# Altium project Sterownik.PrjPcb (part 1 of 2)
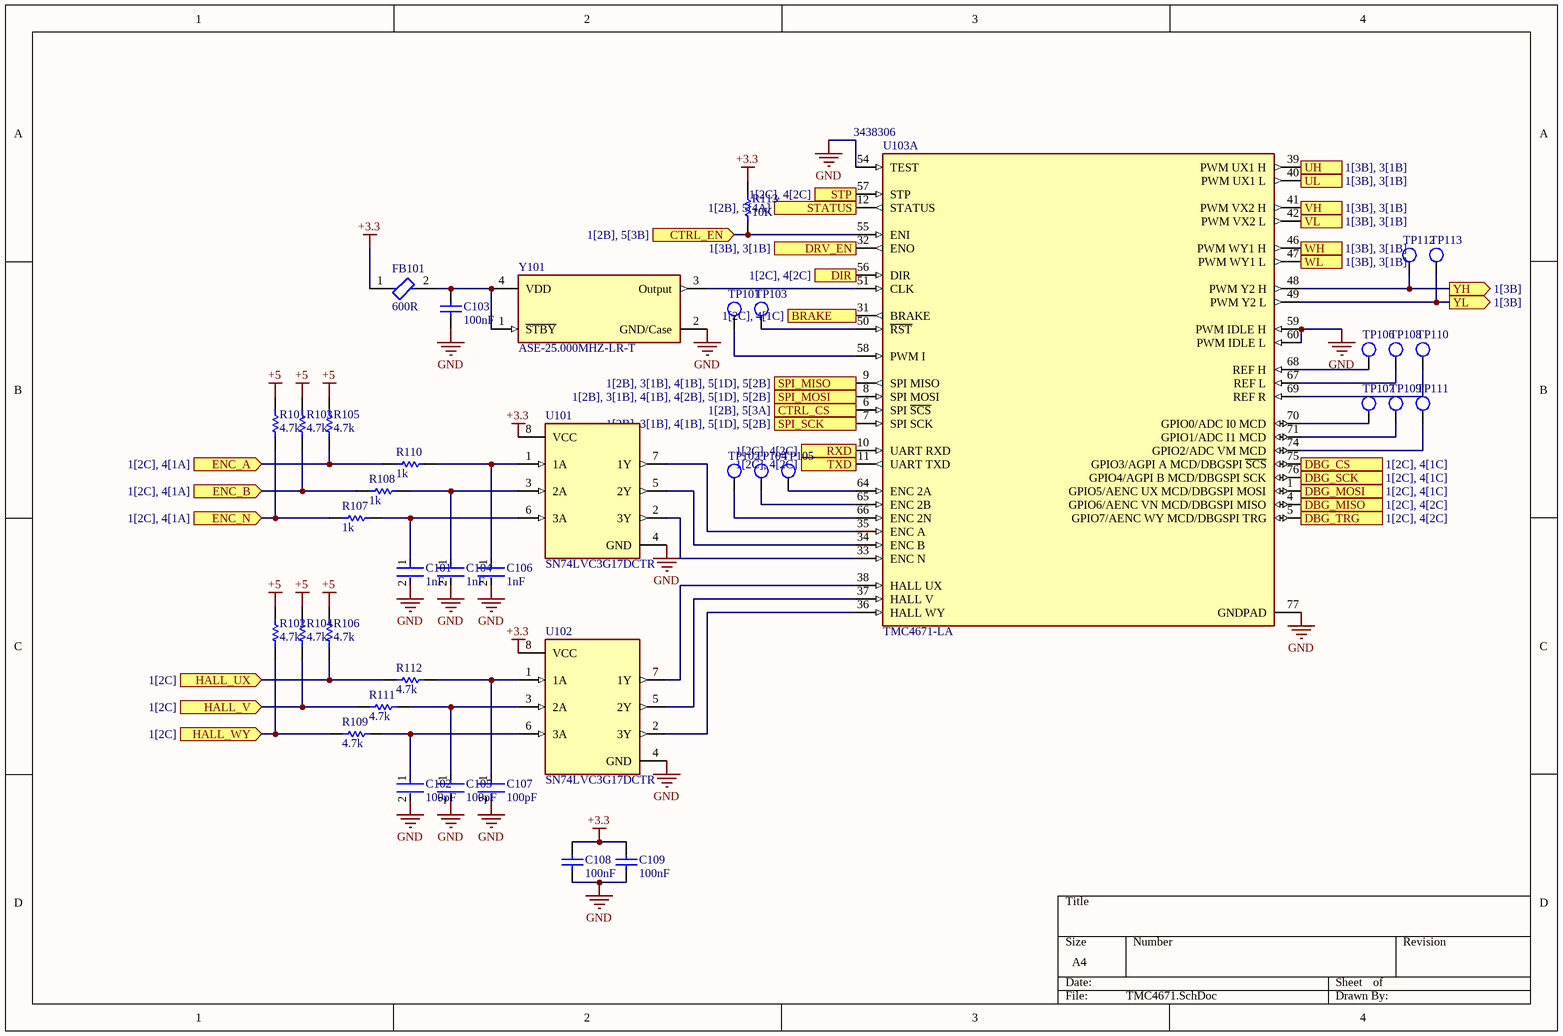
[diagram p0: TMC4671.SchDoc]
5 sheets, 135 parts. Net scope: flat (ports and power ports of the same name join across sheets).
Board file: PCB1.PcbDoc
Sheets:
  TMC4671.SchDoc
  TMC6100.SchDoc
  Connectors.SchDoc
  MOSFETs.SchDoc
  Power.SchDoc

## Sheet TMC4671.SchDoc
size A4; SheetNumber: 2; SheetTotal: 7

### Parts
C101  1nF  [FP-C0603C-CF-MFG]
C102  100pF  [FP-C0603C-CF-IPC_B]
C103  100nF  [CAPC1608X90X35NL10T15]
C104  1nF  [FP-C0603C-CF-MFG]
C105  100pF  [FP-C0603C-CF-IPC_B]
C106  1nF  [FP-C0603C-CF-MFG]
C107  100pF  [FP-C0603C-CF-IPC_B]
C108  100nF  [CAPC1608X90X35NL10T15]
C109  100nF  [CAPC1608X90X35NL10T15]
FB101  600R  [FP-742792651-MFG]
R101  4.7k  [RESC1608X55X30NL15T15]
R102  4.7k  [RESC1608X55X30NL15T15]
R103  4.7k  [RESC1608X55X30NL15T15]
R104  4.7k  [RESC1608X55X30NL15T15]
R105  4.7k  [RESC1608X55X30NL15T15]
R106  4.7k  [RESC1608X55X30NL15T15]
R107  1k  [RESC1608X55X30ML15T15]
R108  1k  [RESC1608X55X30ML15T15]
R109  4.7k  [RESC1608X55X30NL15T15]
R110  1k  [RESC1608X55X30ML15T15]
R111  4.7k  [RESC1608X55X30NL15T15]
R112  4.7k  [RESC1608X55X30NL15T15]
R113  10K  [RESC1609X55X30LL15T15]
TP101  TestPoint  [PCBComponent_1]  (value not drawn)  (no BOM)
TP102  TestPoint  [PCBComponent_1]  (value not drawn)  (no BOM)
TP103  TestPoint  [PCBComponent_1]  (value not drawn)  (no BOM)
TP104  TestPoint  [PCBComponent_1]  (value not drawn)  (no BOM)
TP105  TestPoint  [PCBComponent_1]  (value not drawn)  (no BOM)
TP106  TestPoint  [PCBComponent_1]  (value not drawn)  (no BOM)
TP107  TestPoint  [PCBComponent_1]  (value not drawn)  (no BOM)
TP108  TestPoint  [PCBComponent_1]  (value not drawn)  (no BOM)
TP109  TestPoint  [PCBComponent_1]  (value not drawn)  (no BOM)
TP110  TestPoint  [PCBComponent_1]  (value not drawn)  (no BOM)
TP111  TestPoint  [PCBComponent_1]  (value not drawn)  (no BOM)
TP112  TestPoint  [PCBComponent_1]  (value not drawn)  (no BOM)
TP113  TestPoint  [PCBComponent_1]  (value not drawn)  (no BOM)
U101  SN74LVC3G17DCTR  [FP-DCT0008A-IPC_B]
U102  SN74LVC3G17DCTR  [FP-DCT0008A-IPC_B]
U103  TMC4671-LA  Supplier Part Number 1: 3438306  [FP-TMC4671-LA-IPC_A]  (part A of 2)
Y101  ASE-25.000MHZ-LR-T  [FP-ASE-MFG]

### Ports
BRAKE (out, see 1[2C], 4[1C]), CTRL_CS (in, see 1[2B], 5[3A]), CTRL_EN (in, see 1[2B], 5[3B]), DBG_CS (out, see 1[2C], 4[1C]), DBG_MISO (in, see 1[2C], 4[2C]), DBG_MOSI (out, see 1[2C], 4[1C]), DBG_SCK (out, see 1[2C], 4[1C]), DBG_TRG (out, see 1[2C], 4[2C]), DIR (in, see 1[2C], 4[2C]), DRV_EN (out, see 1[3B], 3[1B]), ENC_A (in, see 1[2C], 4[1A]), ENC_B (in, see 1[2C], 4[1A]), ENC_N (in, see 1[2C], 4[1A]), HALL_UX (in, see 1[2C]), HALL_V (in, see 1[2C]), HALL_WY (in, see 1[2C]), RXD (in, see 1[2C], 4[2C]), SPI_MISO (out, see 1[2B], 3[1B], 4[1B], 5[1D], 5[2B]), SPI_MOSI (in, see 1[2B], 3[1B], 4[1B], 4[2B], 5[1D], 5[2B]), SPI_SCK (in, see 1[2B], 3[1B], 4[1B], 5[1D], 5[2B]), STATUS (out, see 1[2B], 5[4A]), STP (in, see 1[2C], 4[2C]), TXD (out, see 1[2C], 4[2C]), UH (out, see 1[3B], 3[1B]), UL (out, see 1[3B], 3[1B]), VH (out, see 1[3B], 3[1B]), VL (out, see 1[3B], 3[1B]), WH (out, see 1[3B], 3[1B]), WL (out, see 1[3B], 3[1B]), YH (out, see 1[3B]), YL (out, see 1[3B])

### Nets
+3.3: C108.1 C109.1 FB101.1 R113.2 U101.8(VCC) U102.8(VCC)
+5: R101.2 R102.2 R103.2 R104.2 R105.2 R106.2
GND: C101.2 C102.2 C103.2 C104.2 C105.2 C106.2 C107.2 C108.2 C109.2 U101.4(GND) U102.4(GND) U103.54(TEST) U103.59(PWM_IDLE_H) U103.60(PWM_IDLE_L) U103.77(GNDPAD) Y101.2(GND/Case)
NetC101_1: C101.1 R107.2 U101.6(3A)
NetC102_1: C102.1 R109.1 U102.6(3A)
NetC103_1: C103.1 FB101.2 Y101.1(~{STBY}) Y101.4(VDD)
NetC104_1: C104.1 R108.2 U101.3(2A)
NetC105_1: C105.1 R111.1 U102.3(2A)
NetC106_1: C106.1 R110.2 U101.1(1A)
NetC107_1: C107.1 R112.1 U102.1(1A)
NetJ403_2: R105.1 R110.1 ; port ENC_A
NetJ403_3: R103.1 R108.1 ; port ENC_B
NetJ403_4: R101.1 R107.1 ; port ENC_N
NetJ404_2: R106.1 R112.2 ; port HALL_UX
NetJ404_3: R104.1 R111.2 ; port HALL_V
NetJ404_4: R102.1 R109.2 ; port HALL_WY
NetJ405_2: U103.7(SPI_SCK) ; port SPI_SCK
NetJ405_4: U103.8(SPI_MOSI) ; port SPI_MOSI
NetJ405_5: U103.9(SPI_MISO) ; port SPI_MISO
NetP405_3: U103.75(GPIO3/AGPI_A_MCD/DBGSPI_~{SCS}) ; port DBG_CS
NetP405_4: U103.4(GPIO6/AENC_VN_MCD/DBGSPI_MISO) ; port DBG_MISO
NetP405_5: U103.76(GPIO4/AGPI_B_MCD/DBGSPI_SCK) ; port DBG_SCK
NetP405_6: U103.5(GPIO7/AENC_WY_MCD/DBGSPI_TRG) ; port DBG_TRG
NetP405_7: U103.1(GPIO5/AENC_UX_MCD/DBGSPI_MOSI) ; port DBG_MOSI
NetP406_1: U103.31(BRAKE) ; port BRAKE
NetP408_1: U103.11(UART_TXD) ; port TXD
NetP408_2: U103.10(UART_RXD) ; port RXD
NetP409_1: U103.57(STP) ; port STP
NetP409_2: U103.56(DIR) ; port DIR
NetR113_1: R113.1 U103.55(ENI) ; port CTRL_EN
NetTP101_1: TP101.1 U103.58(PWM_I)
NetTP102_1: TP102.1 U103.66(ENC_2N)
NetTP103_1: TP103.1 U103.50(~{RST})
NetTP104_1: TP104.1 U103.65(ENC_2B)
NetTP105_1: TP105.1 U103.64(ENC_2A)
NetTP106_1: TP106.1 U103.68(REF_H)
NetTP107_1: TP107.1 U103.70(GPIO0/ADC_I0_MCD)
NetTP108_1: TP108.1 U103.67(REF_L)
NetTP109_1: TP109.1 U103.71(GPIO1/ADC_I1_MCD)
NetTP110_1: TP110.1 U103.69(REF_R)
NetTP111_1: TP111.1 U103.74(GPIO2/ADC_VM_MCD)
NetTP112_1: TP112.1 U103.48(PWM_Y2_H) ; port YH
NetTP113_1: TP113.1 U103.49(PWM_Y2_L) ; port YL
NetU101_2: U101.2(3Y) U103.33(ENC_N)
NetU101_5: U101.5(2Y) U103.34(ENC_B)
NetU101_7: U101.7(1Y) U103.35(ENC_A)
NetU102_2: U102.2(3Y) U103.36(HALL_WY)
NetU102_5: U102.5(2Y) U103.37(HALL_V)
NetU102_7: U102.7(1Y) U103.38(HALL_UX)
NetU103_6: U103.6(SPI_~{SCS}) ; port CTRL_CS
NetU103_12: U103.12(STATUS) ; port STATUS
NetU103_32: U103.32(ENO) ; port DRV_EN
NetU103_39: U103.39(PWM_UX1_H) ; port UH
NetU103_40: U103.40(PWM_UX1_L) ; port UL
NetU103_41: U103.41(PWM_VX2_H) ; port VH
NetU103_42: U103.42(PWM_VX2_L) ; port VL
NetU103_46: U103.46(PWM_WY1_H) ; port WH
NetU103_47: U103.47(PWM_WY1_L) ; port WL
NetU103_51: U103.51(CLK) Y101.3(Output)

### Library data of the parts
C101 C104 C106 = CMP-2006-03015-2: CAP CER 1000PF 100V 10% X7R 0603; Manufacturer: KEMET; Manufacturer Part Number: C0603C102K1RACTU; Value: 1,000 pF; Tolerance: 0.1; Automotive Grade: Grade 1; Temperature Coefficient: 30ppm/°C; Material: Ceramic; Temperature Range High: +125°C; RoHS: TRUE; Temperature Range Low: -55°C; ComponentLink2URL: https://api.kemet.com/component-edge/download/datasheet/C0603C100J5GACAUTO.pdf; Lead Free: Yes; Device Class L2: Capacitors; Voltage Rating: 100 V; Package: C0603C-CF; Category: Cap; Temperature: -55°C to +125°C; Device Class L3: Ceramic Capacitors; Mouser Description: Multilayer Ceramic Capacitors MLCC - SMD/SMT 100volts 1000pF X7R 10%; Height: 0.87mm; ComponentLink2Description: Datasheet; Digikey Description: CAP CER 1000PF 100V 10% X7R 0603; Temperature Characteristic: X7R; Capacitance: 1,000 pF; Automotive: Yes; Octopart: https://octopart.com/c0603c102k1ractu-kemet-9138575; Device Class L1: Passive Components
C102 C105 C107 = CMP-2006-03007-2: CAP CER 100PF 50V 10% X7R 0603; Manufacturer: KEMET; Manufacturer Part Number: C0603C101K5RACTU; Tolerance: 0.1; Material: Ceramic; Temperature Coefficient: 30ppm/°C; Automotive Grade: Grade 1; Value: 100 pF; RoHS: TRUE; ComponentLink2Description: Datasheet; Device Class L2: Capacitors; Category: Cap; Package: C0603C-CF; Automotive: Yes; Temperature Range High: +125°C; Temperature Range Low: -55°C; Temperature Characteristic: X7R; Device Class L3: Ceramic Capacitors; Mouser Description: Multilayer Ceramic Capacitors MLCC - SMD/SMT 50volts 100pF 10%; Device Class L1: Passive Components; Capacitance: 100 pF; Height: 0.87mm; ComponentLink2URL: https://api.kemet.com/component-edge/download/datasheet/C0603C100J5GACAUTO.pdf; Temperature: -55°C to +125°C; Octopart: https://octopart.com/c0603c101k5ractu-kemet-10561249; Digikey Description: CAP CER 100PF 50V 10% X7R 0603; Voltage Rating: 50 V; Lead Free: Yes
C103 C108 C109 = CMP-2100-03643-1: Chip Capacitor, 0.1 uF, +/- 10%, 50 V, -55 to 125 degC, 0603 (1608 Metric), RoHS, Tape and Reel; Manufacturer: Murata; Dielectric Material: Ceramic; Voltage Rating: 50V; Dielectric: X7R; Insulation Resistance: 10GR; Case Code (Metric): 1608; Lead Free: LeadFree; Depth: 0.8mm; Number of Pins: 2; Radiation Hardening: No; Case/Package: 0603; Manufacturer URL: http://www.murata.com/; Packaging: TapeandReel; Length: 1.6mm; Contact Plating: Tin; Datasheet URL: http://psearch.en.murata.com/capacitor/product/GRM188R71H104KA93%23.pdf; Tolerance: 10%; Case Code (Imperial): 0603; Min Operating Temperature: -55degC; RoHSCompliant: true; Capacitance: 100nF; Voltage: 50V; Termination: SMD/SMT; Mount: SurfaceMount; Material: Ceramic; Package Quantity: 1; Height: 0.8mm; Thickness: 0.035inch; REACH SVHC: NoSVHC; Max Operating Temperature: 125degC; Width: 0.8mm; Package Reference: 0603; Voltage Rating (DC): 50V; Datasheet Version: 42675.0; Package Description: 2-Pin Surface Mount Device, Body 1.6 x 0.8 mm
FB101 = CMP-0220-00181-2: FERRITE BEAD 600 OHM 0603 1LN; Tolerance: 25%; DC Resistance (DCR): 200mR; Inductance: 0.36H; Current Rating: 1A; Test Frequency: 100MHz; Number of Lines: 1; Length: 1.6mm; Termination: SMD/SMT; Case Code (Metric): 1608; Case/Package: SMD/SMT; Min Operating Temperature: -55°C; Resistance: 200mR; Height: 0.8mm; Width: 0.8mm; Max Operating Temperature: 125°C; Package Quantity: 1; Mount: Surface Mount; Max DC Current: 1A; Max Current Rating: 1A; Weight: 0.000141oz; Packaging: Tape and Reel; Lead Free: Lead Free; Case Code (Imperial): 0603; Series: WE-CBF; Impedance: 600R; Core Material: Ferrite; Material: Ferrite; RoHS Compliant: Yes; Depth: 0.8mm
R101-R106 R109 R111 R112 = CMP-1012-00586-3: Precision Thick Film Chip Resistor, 4.7 KOhm, +/- 1%, -55 to 155 degC, 0603 (1608 Metric), RoHS, Tape and Reel; Resistance: 220 Ohm; Voltage Rating: 50 V; Elements: 4; Case\Package: 1205; Tolerance: 5%; Power Rating: 250 mW; PackageReference: 0603; Max Operating Temperature: 125 degC; REACH SVHC: No SVHC; Width: 0.063 inch; Length: 0.126 inch; Height: 0.024 inch; Mount: Surface Mount; Package Quantity: 1; DatasheetVersion: Apr-15; ComponentLink1Description: Manufacturer URL; Min Operating Temperature: -55 degC; Packaging: Tape and Reel; Radiation Hardening: No; ComponentLink2URL: http://industrial.panasonic.com/cdbs/www-data/pdf/RDA0000/AOA0000C86.pdf; Case Code (Metric): 3216; Pins: 8; Case Code (Imperial): 1206; Type (Resistor): Thick Film; RoHSCompliant: true; ComponentLink2Description: Datasheet; PackageDescription: 2-Pin Surface Mount Device, Body 1.6 x 0.85 mm; ComponentLink1URL: http://www.panasonic.com/
R107 R108 R110 = CMP-2000-00180-1: Part Number: ERJ-3EKF1001V; Manufacturer: Panasonic
R113 = CMP-1012-00623-3: Chip Resistor, 10 KOhm, +/- 1%, 0.1 W, -55 to 155 degC, 0603 (1608 Metric), RoHS, Tape and Reel; Manufacturer: Panasonic; Voltage Rating: 75V; Case\/Package: 0603; Power Rating: 100mW; Resistance: 10KOhm; Temperature Coefficient: 100ppm\/degreesC; Number of Pins: 2; Package Reference: 603; Depth: 0.8mm; Mount: SurfaceMount; Package Description: 2-Pin Surface Mount Device, Body 1.6 x 0.85 mm; Datasheet Version: 02/2017; Length: 1.6mm; Lead Free: LeadFree; Height: 0.45mm; Number of Terminations: 2; Max Power Dissipation: 100mW; Min Operating Temperature: -55degC; Datasheet URL: https://industrial.panasonic.com/cdbs/www-data/pdf/RDA0000/AOA0000C304.pdf; Termination: SMD/SMT; Case Code (Metric): 1608; Case Code (Imperial): 0603; Tolerance: 1%; Max Operating Temperature: 155degC; RoHSCompliant: true; Voltage Rating (DC): 75V; Radiation Hardening: No; Packaging: TapeandReel; Composition: ThickFilm; Mounting Technology: SurfaceMount; Manufacturer URL: http://www.panasonic.com/; Width: 0.031inch; REACH SVHC: NoSVHC; Contact Plating: Tin; Military Standard: Not; Package Quantity: 1
U101 U102 = CMP-0859-00525-5: IC BUFFER NON-INVERT 5.5V SM8; Manufacturer: Texas Instruments; Logic Function Desc: Non-Inverting; Propagation Delay: 5.1ns; Number Of Inputs: 3; Standoff Height: 0mm; Nominal Supply Current: 10uA; Min Supply Voltage: 1.65V; ComponentLink2URL: http://www.ti.com/lit/ds/symlink/sn74lvc3g17.pdf; Temperature: -40°C to +125°C; Device Class L1: Integrated Circuits (ICs); Mouser Description: Buffers & Line Drivers TRIPLE SCHMITT- TRIGGER BUFFER; Temperature Range Low: -40°C; Octopart: https://octopart.com/sn74lvc3g17dctr-texas+instruments-423176; Number Of Outputs: 3; Manufacturer Part Number: SN74LVC3G17DCTR; Device Class L2: Logic ICs; Ambient Temperature Range Low: -40°C; Max Supply Voltage: 5.5V; Automotive: No; Temperature Range High: +125°C; Category: IC; Digikey Description: IC BUFFER NON-INVERT 5.5V SM8; Package: DCT0008A; Device Class L3: Buffers; Height: 1.3mm; RoHS: TRUE; Lead Free: Yes; Ambient Temperature Range High: +125°C; Ipc Land Pattern Name: SOP65P400X130-8; ComponentLink2Description: Datasheet; Number Of Circuits: 3
U103 = CMP-237673-000008-1: SERVO CONTROLLER IC, QFN76; Supplier 1: Farnell
Y101 = CMP-27762-000357-1: XTAL Oscillator 25MHz ±25ppm CMOS 3.3V 4-SMD 3.2mm x 2.5mm; Min Supply Voltage: 3.135V; Max Supply Current: 13mA; Max Supply Voltage: 3.465V; Load Capacitance: 15pF; Height: 0.047inch; Series: ASE; Frequency Stability: 25ppm; Mount: Surface Mount; Case/Package: SMD/SMT; Width: 0.098inch; Operating Frequency: 25 MHz; REACH SVHC: No SVHC; Package Quantity: 1000; Number of Pins: 4; Termination: SMD/SMT; Frequency: 25MHz; Max Operating Temperature: 85°C; Packaging: Tape and Reel; Min Operating Temperature: -40°C; Lead Free: Lead Free; Length: 0.126inch; Operating Supply Voltage: 3.3V

## Sheet TMC6100.SchDoc
size A4; SheetNumber: 3; SheetTotal: 7
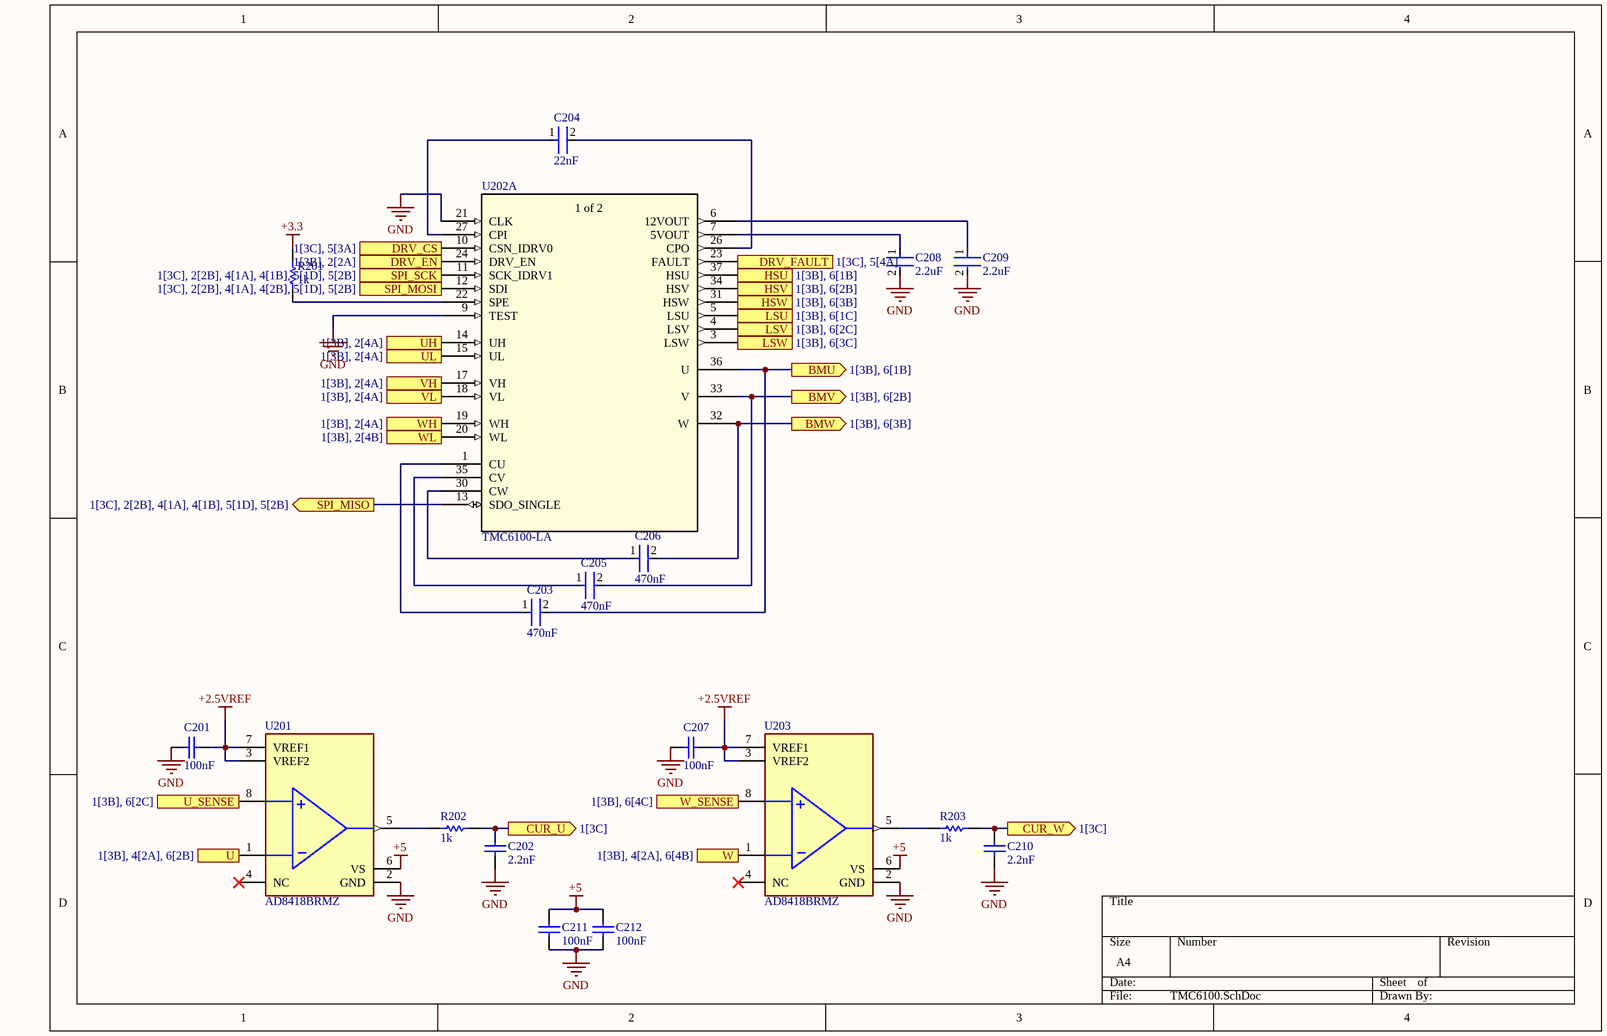
[diagram p1: TMC6100.SchDoc]

### Parts
C201  100nF  [CAPC1608X90X35NL10T15]
C202  2.2nF  [CAPC1608X95X40ML15T15]
C203  470nF  [FP-0603-L_1_6_0_1-W_0_8_0-IPC_B]
C204  22nF  [FP-C0603C-CF-MFG]
C205  470nF  [FP-0603-L_1_6_0_1-W_0_8_0-IPC_B]
C206  470nF  [FP-0603-L_1_6_0_1-W_0_8_0-IPC_B]
C207  100nF  [CAPC1608X90X35NL10T15]
C208  2.2uF  [FP-0603-L_1_6_0_2-W_0_8_0-IPC_B]
C209  2.2uF  [FP-0603-L_1_6_0_2-W_0_8_0-IPC_B]
C210  2.2nF  [CAPC1608X95X40ML15T15]
C211  100nF  [CAPC1608X90X35NL10T15]
C212  100nF  [CAPC1608X90X35NL10T15]
R201  1k  [RESC1608X55X30ML15T15]
R202  1k  [RESC1608X55X30ML15T15]
R203  1k  [RESC1608X55X30ML15T15]
U201  AD8418BRMZ  [FP-RM-8-IPC_B]
U202  TMC6100-LA  [QFN37_7X7_TRI-M]  (part A of 2)
U203  AD8418BRMZ  [FP-RM-8-IPC_B]

### Ports
BMU (out, see 1[3B], 6[1B]), BMV (out, see 1[3B], 6[2B]), BMW (out, see 1[3B], 6[3B]), CUR_U (out, see 1[3C]), CUR_W (out, see 1[3C]), DRV_CS (in, see 1[3C], 5[3A]), DRV_EN (in, see 1[3B], 2[2A]), DRV_FAULT (out, see 1[3C], 5[4A]), HSU (out, see 1[3B], 6[1B]), HSV (out, see 1[3B], 6[2B]), HSW (out, see 1[3B], 6[3B]), LSU (out, see 1[3B], 6[1C]), LSV (out, see 1[3B], 6[2C]), LSW (out, see 1[3B], 6[3C]), SPI_MISO (out, see 1[3C], 2[2B], 4[1A], 4[1B], 5[1D], 5[2B]), SPI_MOSI (in, see 1[3C], 2[2B], 4[1A], 4[2B], 5[1D], 5[2B]), SPI_SCK (in, see 1[3C], 2[2B], 4[1A], 4[1B], 5[1D], 5[2B]), U (in, see 1[3B], 4[2A], 6[2B]), U_SENSE (in, see 1[3B], 6[2C]), UH (in, see 1[3B], 2[4A]), UL (in, see 1[3B], 2[4A]), VH (in, see 1[3B], 2[4A]), VL (in, see 1[3B], 2[4A]), W (see 1[3B], 4[2A], 6[4B]), W_SENSE (see 1[3B], 6[4C]), WH (in, see 1[3B], 2[4A]), WL (in, see 1[3B], 2[4B])

### Nets
+2.5VREF: C201.1 C207.1 U201.3(VREF2) U201.7(VREF1) U203.3(VREF2) U203.7(VREF1)
+3.3: R201.2
+5: C211.1 C212.1 U201.6(VS) U203.6(VS)
GND: C201.2 C202.1 C207.2 C208.2 C209.2 C210.1 C211.2 C212.2 U201.2(GND) U202.9(TEST) U202.21(CLK) U203.2(GND)
NetC202_2: C202.2 R202.2 ; port CUR_U
NetC203_1: C203.1 U202.1(CU)
NetC203_2: C203.2 U201.8(+IN) U202.36(U) ; port BMU, port U_SENSE
NetC204_1: C204.1 U202.27(CPI)
NetC204_2: C204.2 U202.26(CPO)
NetC205_1: C205.1 U202.35(CV)
NetC205_2: C205.2 U202.33(V) ; port BMV
NetC206_1: C206.1 U202.30(CW)
NetC206_2: C206.2 U202.32(W) U203.8(+IN) ; port BMW, port W_SENSE
NetC208_1: C208.1 U202.7(5VOUT)
NetC209_1: C209.1 U202.6(12VOUT)
NetC210_2: C210.2 R203.2 ; port CUR_W
NetJ405_2: U202.11(SCK_IDRV1) ; port SPI_SCK
NetJ405_4: U202.12(SDI) ; port SPI_MOSI
NetJ405_5: U202.13(SDO_SINGLE) ; port SPI_MISO
NetP410_1: U201.1(-IN) ; port U
NetP410_3: U203.1(-IN) ; port W
NetR201_1: R201.1 U202.22(SPE)
NetR202_1: R202.1 U201.5(OUT)
NetR203_1: R203.1 U203.5(OUT)
NetR601_1: U202.37(HSU) ; port HSU
NetR602_1: U202.5(LSU) ; port LSU
NetR604_1: U202.34(HSV) ; port HSV
NetR605_1: U202.4(LSV) ; port LSV
NetR606_1: U202.31(HSW) ; port HSW
NetR607_1: U202.3(LSW) ; port LSW
NetU103_32: U202.24(DRV_EN) ; port DRV_EN
NetU103_39: U202.14(UH) ; port UH
NetU103_40: U202.15(UL) ; port UL
NetU103_41: U202.17(VH) ; port VH
NetU103_42: U202.18(VL) ; port VL
NetU103_46: U202.19(WH) ; port WH
NetU103_47: U202.20(WL) ; port WL
NetU202_10: U202.10(CSN_IDRV0) ; port DRV_CS
NetU202_23: U202.23(FAULT) ; port DRV_FAULT

Not connected (* = marked no-connect by the designer): U201 4(NC)*; U203 4(NC)*

### Notes on the sheet
- (in symbol TMC6100-LA, part A) 1 of 2

### Library data of the parts
C201 C207 C211 C212 = CMP-2100-03643-1: as C103 on sheet TMC4671; Case Code (Metric): 1608; Lead Free: LeadFree; Depth: 0.8mm; Number of Pins: 2; Radiation Hardening: No; Case/Package: 0603; Manufacturer URL: http://www.murata.com/; Packaging: TapeandReel; Length: 1.6mm; Contact Plating: Tin; Datasheet URL: http://psearch.en.murata.com/capacitor/product/GRM188R71H104KA93%23.pdf; Tolerance: 10%; Case Code (Imperial): 0603; Min Operating Temperature: -55degC; RoHSCompliant: true; Capacitance: 100nF; Voltage: 50V; Termination: SMD/SMT; Mount: SurfaceMount; Material: Ceramic; Package Quantity: 1; Height: 0.8mm; Thickness: 0.035inch; REACH SVHC: NoSVHC; Max Operating Temperature: 125degC; Width: 0.8mm; Package Reference: 0603; Voltage Rating (DC): 50V; Datasheet Version: 42675.0; Package Description: 2-Pin Surface Mount Device, Body 1.6 x 0.8 mm
C202 C210 = CMP-2006-00064-1: Manufacturer: Vitramon; Part Number: VJ0603Y222KXACW1BC
C203 C205 C206 = CMP-14477-000135-2: None; Dielectric: X7R; Voltage Rating: 50V; Tolerance: 10%; Series: M; Package Quantity: 1; Radiation Hardening: No; Packaging: Tape and Reel; Length: 1.6mm; Min Operating Temperature: -55°C; Case Code (Imperial): 0603; Capacitance: 470nF; Construction: Flat; Max Operating Temperature: 125°C; Thickness: 0.035inch; Case Code (Metric): 1608; Depth: 0.8mm; Voltage: 50V; Case/Package: 0603; RoHS Compliant: Yes; Mount: Surface Mount; Lead Free: Lead Free; Width: 0.031inch; Halogen Free: Halogen Free; Height: 0.8mm; Termination: SMD/SMT; Voltage Rating (DC): 50V
C204 = CMP-2006-03137-2: CAP CER 0.022UF 100V X7R 0603; Manufacturer: KEMET; Manufacturer Part Number: C0603C223K1RACTU; Material: Ceramic; Temperature Coefficient: 30ppm/°C; Value: 22,000 pF; Tolerance: 0.1; Automotive Grade: Grade 1; Voltage Rating: 100 V; Temperature Range High: +125°C; Temperature: -55°C to +125°C; Digikey Description: CAP CER 0.022UF 100V X7R 0603; Lead Free: Yes; ComponentLink2Description: Datasheet; Height: 0.87mm; Category: Cap; Device Class L3: Ceramic Capacitors; Device Class L2: Capacitors; Octopart: https://octopart.com/c0603c223k1ractu-kemet-150702; Package: C0603C-CF; Temperature Characteristic: X7R; Automotive: Yes; ComponentLink2URL: https://api.kemet.com/component-edge/download/datasheet/C0603C100J5GACAUTO.pdf; Capacitance: 22,000 pF; Temperature Range Low: -55°C; Device Class L1: Passive Components; RoHS: TRUE; Mouser Description: Multilayer Ceramic Capacitors MLCC - SMD/SMT 100volts 0.022uF 10% X7R
C208 C209 = CMP-14477-000078-3: Multilayer Ceramic Capacitor 2.2uF 16V X7R 10% SMD 0603 T/R; Width: 0.031inch; Tolerance: 10%; Thickness: 0.035inch; Case/Package: 0603; Voltage Rating (DC): 16V; Voltage Rating: 16V; Halogen Free: Halogen Free; RoHS Compliant: Yes; Min Operating Temperature: -55°C; Length: 0.063inch; Mount: Surface Mount; Capacitance: 2.2uF; Max Operating Temperature: 125°C; Packaging: Tape and Reel
R201-R203 = CMP-2000-00180-1: as R107 on sheet TMC4671
U201 U203 = CMP-09116-000026-1: IC CURR SENSE 1 CIRCUIT 8MSOP; Manufacturer: Analog Devices; Min Supply Voltage: 2.7V; Input Bias Current: 130uA; Number Of Channels: 1; Max Supply Voltage: 5.5V; Voltage Gain: 0.02V/mV; Bandwidth: 250kHz; Standoff Height: 0.05mm; Nominal Supply Current: 2.6mA; Input Offset Voltage: 0.2mV; Automotive: No; Temperature: -40°C to +125°C; Octopart: https://octopart.com/ad8418brmz-analog+devices-21054230; ComponentLink2Description: Datasheet; Device Class L1: Integrated Circuits (ICs); ComponentLink2URL: https://www.analog.com/media/en/technical-documentation/data-sheets/AD8418.pdf; Digikey Description: IC CURR SENSE 1 CIRCUIT 8MSOP; Ipc Land Pattern Name: SOP65P490X110-8; Temperature Range Low: -40°C; Device Class L3: Instrumentation; Height: 1.1mm; Mouser Description: Current Sense Amplifier, Bidirectional, 1, 130 A, MSOP, 8, -40 C, 125 C; Lead Free: Yes; Manufacturer Part Number: AD8418BRMZ; Category: IC; Package: RM-8; Device Class L2: Linear ICs; Temperature Range High: +125°C; RoHS: TRUE
U202 = TMC6100-LA: No Description Available; Mfr_Name: Trinamic; RefDes: RefDes; Type: Type

## Sheet Connectors.SchDoc
size A4; SheetNumber: 4; SheetTotal: 7
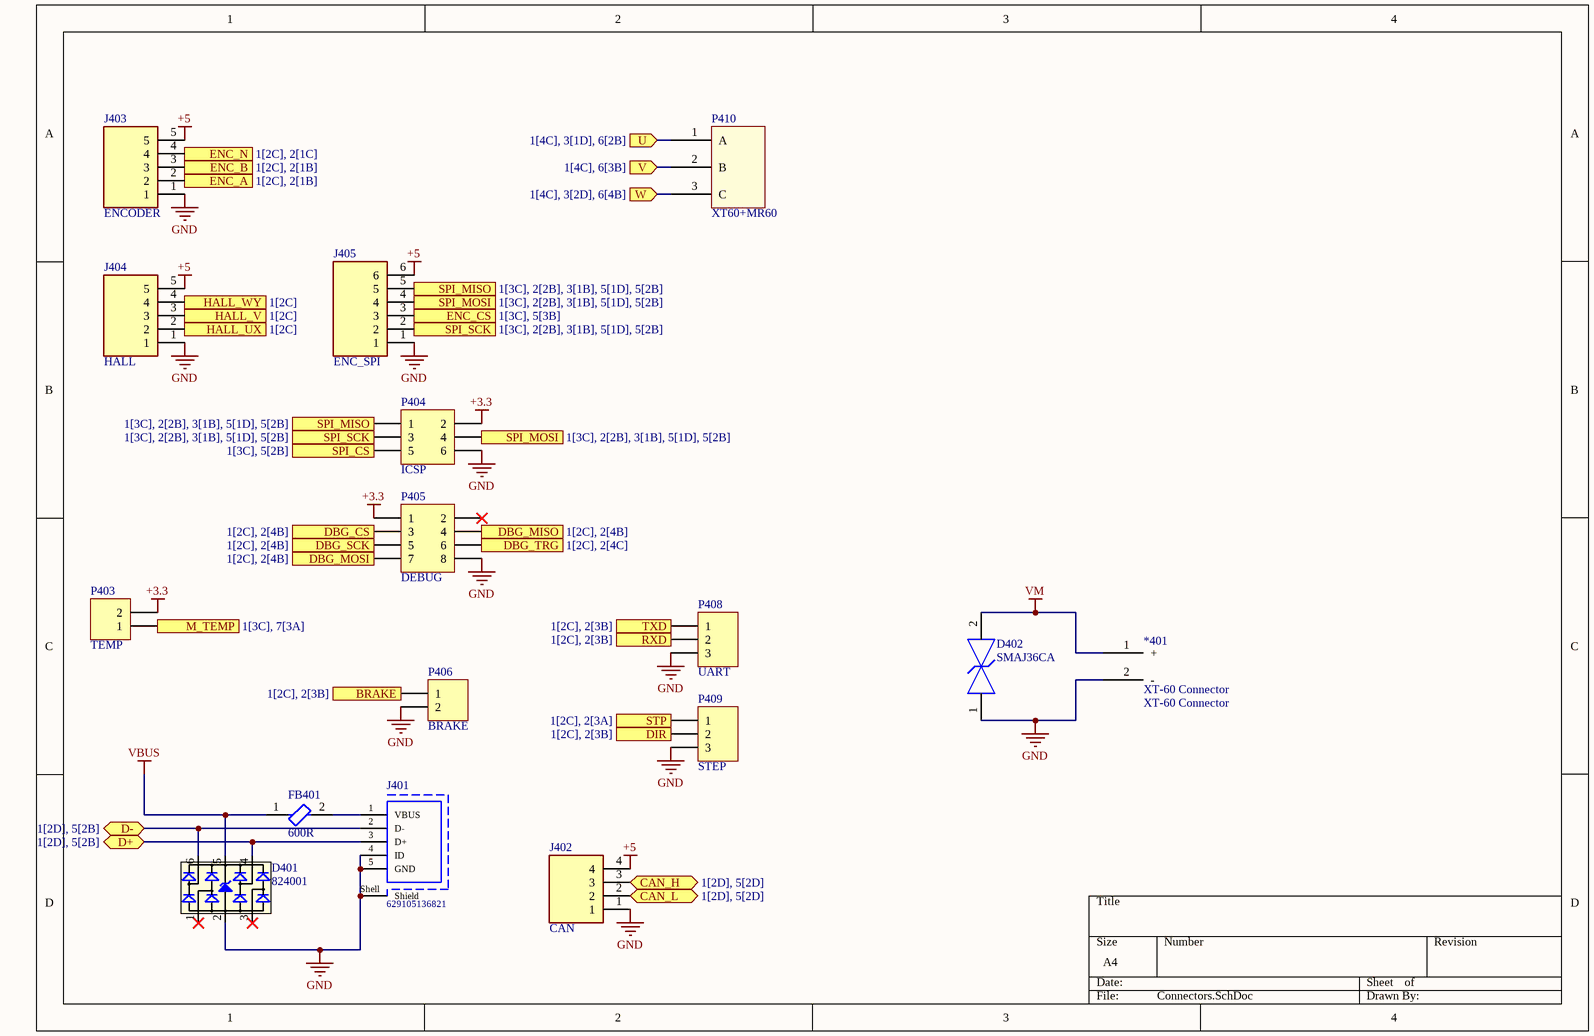
[diagram p2: Connectors.SchDoc]

### Parts
*401  XT-60 Connector  [XT-60]
D401  824001  [SOT23_6L]
D402  SMAJ36CA  [FP-SMAJ-CA-MFG]
FB401  600R  [FP-742792651-MFG]
J401  629105136821  [629105136821]
J402  CAN  [SHDRRA4W60P0X250_1X4_1170X750X510P]
J403  ENCODER  [PTSM5]
J404  HALL  [PTSM5]
J405  ENC_SPI  [PTSM6]
P403  TEMP  [HDR1X2]
P404  ICSP  [HDR2X3]
P405  DEBUG  [HDR2X4]
P406  BRAKE  [HDR1X2]
P408  UART  [HDR1X3]
P409  STEP  [HDR1X3]
P410  XT60+MR60  [XT60+MR60]

### Ports
BRAKE (in, see 1[2C], 2[3B]), CAN_H (bidir, see 1[2D], 5[2D]), CAN_L (bidir, see 1[2D], 5[2D]), D+ (bidir, see 1[2D], 5[2B]), D- (bidir, see 1[2D], 5[2B]), DBG_CS (in, see 1[2C], 2[4B]), DBG_MISO (out, see 1[2C], 2[4B]), DBG_MOSI (in, see 1[2C], 2[4B]), DBG_SCK (in, see 1[2C], 2[4B]), DBG_TRG (in, see 1[2C], 2[4C]), DIR (out, see 1[2C], 2[3B]), ENC_A (out, see 1[2C], 2[1B]), ENC_B (out, see 1[2C], 2[1B]), ENC_CS (in, see 1[3C], 5[3B]), ENC_N (out, see 1[2C], 2[1C]), HALL_UX (out, see 1[2C]), HALL_V (out, see 1[2C]), HALL_WY (out, see 1[2C]), M_TEMP (out, see 1[3C], 7[3A]), RXD (out, see 1[2C], 2[3B]), SPI_CS (out, see 1[3C], 5[2B]), SPI_MISO (out, see 1[3C], 2[2B], 3[1B], 5[1D], 5[2B]), SPI_MOSI (in, see 1[3C], 2[2B], 3[1B], 5[1D], 5[2B]), SPI_SCK (in, see 1[3C], 2[2B], 3[1B], 5[1D], 5[2B]), SPI_SCK (out, see 1[3C], 2[2B], 3[1B], 5[1D], 5[2B]), STP (out, see 1[2C], 2[3A]), TXD (in, see 1[2C], 2[3B]), U (in, see 1[4C], 3[1D], 6[2B]), V (in, see 1[4C], 6[3B]), W (in, see 1[4C], 3[2D], 6[4B])

### Nets
+3.3: P403.2 P404.2 P405.1
+5: J402.4 J403.5 J404.5 J405.6
GND: *401.2(-) D401.2(GND) D402.1 J401.4(ID) J401.5(GND) J401.Shell(Shield) J402.1 J403.1 J404.1 J405.1 P404.6 P405.8 P406.2 P408.3 P409.3
VBUS: D401.5(VDD) FB401.1
VM: *401.1(+) D402.2
NetC205_2: P410.2(B) ; port V
NetD401_4: D401.4(I/O3) J401.3(D+) ; port D+
NetD401_6: D401.6(I/O4) J401.2(D-) ; port D-
NetFB401_2: FB401.2 J401.1(VBUS)
NetJ402_2: J402.2 ; port CAN_L
NetJ402_3: J402.3 ; port CAN_H
NetJ403_2: J403.2 ; port ENC_A
NetJ403_3: J403.3 ; port ENC_B
NetJ403_4: J403.4 ; port ENC_N
NetJ404_2: J404.2 ; port HALL_UX
NetJ404_3: J404.3 ; port HALL_V
NetJ404_4: J404.4 ; port HALL_WY
NetJ405_2: J405.2 P404.3 ; port SPI_SCK
NetJ405_3: J405.3 ; port ENC_CS
NetJ405_4: J405.4 P404.4 ; port SPI_MOSI
NetJ405_5: J405.5 P404.1 ; port SPI_MISO
NetP403_1: P403.1 ; port M_TEMP
NetP404_5: P404.5 ; port SPI_CS
NetP405_3: P405.3 ; port DBG_CS
NetP405_4: P405.4 ; port DBG_MISO
NetP405_5: P405.5 ; port DBG_SCK
NetP405_6: P405.6 ; port DBG_TRG
NetP405_7: P405.7 ; port DBG_MOSI
NetP406_1: P406.1 ; port BRAKE
NetP408_1: P408.1 ; port TXD
NetP408_2: P408.2 ; port RXD
NetP409_1: P409.1 ; port STP
NetP409_2: P409.2 ; port DIR
NetP410_1: P410.1(A) ; port U
NetP410_3: P410.3(C) ; port W

Not connected (* = marked no-connect by the designer): D401 1(I/O1)* 3(I/O2)*; P405 2*

### Library data of the parts
*401 = XT-60 Connector: Manufacturer: POLOLU; Manufacturer Part Number: XT60 YELLOW; Unit: pcs; SuppliedAmount: 0; MinAmount: 1; Type of robotics accessories: power connector; Maximum current: 65A; Information: Product is not a working device, but only component; Supplier 1: TME; Category: Power Supply Modules; Stock 1: 29; Pricing 1: 1=2.08, 10=1.95 (USD); Weight: 7.267; Multiples: 1; Number of pins: 2; Colour: yellow; Price Type: NET; ComponentLink1URL: http://static.tme.eu/products_pics/8/b/5/8b5040a8a5baf3e0e67386c2e3a9b903/913.jpg; ComponentLink1Description: http://static.tme.eu/products_pics/8/b/5/8b5040a8a5baf3e0e67386c2e3a9b903/913.jpg; Supplier Part Number 1: XT-60 Connector
D401 = CMP-1486-00005-1: TVS Diode WE-TVS-HS, VRWM=5V; Manufacturer: Wuerth Elektronik; Reverse Stand Off Voltage: 5V; ComponentLink2Description: Datasheet; ComponentLink1URL: http://www.we-online.com; ComponentLink2URL: http://katalog.we-online.de/kataloge/eisos/media/pdf/824001.pdf; ComponentLink1Description: Manufacturer URL; PartNumber: 824001; PackageReference: SOT23_6L
D402 = CMP-08607-000009-1: TVS DIODE 36V 58.1V DO214AC; Manufacturer: Littelfuse Inc; Peak Pulse Power: 400W; Max Junction Temp: +150°C; Direction: Bidirectional; Peak Pulse Current: 6.9A; Number Of Channels: 1; Breakdown Voltage: 40V; Lead Free: Yes; Automotive: No; Device Class L1: Circuit Protection; Digikey Description: TVS DIODE 36V 58.1V DO214AC; Package: SMAJ-CA; Manufacturer Part Number: SMAJ36CA; Mouser Description: In a Pack of 25, Littelfuse SMAJ36CA, Bi-Directional TVS Diode, 400W, 2-Pin DO-214AC; Reverse Standoff Voltage: 36V; Temperature: -65°C to +150°C; Clamping Voltage: 58.1V; Height: 2.29mm; Temperature Range High: +150°C; RoHS: TRUE; Category: Diode; ComponentLink2Description: Datasheet; Device Class L2: TVS Diodes; ComponentLink2URL: https://www.littelfuse.com/~/media/electronics/datasheets/tvs_diodes/littelfuse_tvs_diode_smaj_datasheet.pdf.pdf; Octopart: https://octopart.com/smaj36ca-littelfuse-350098; Device Class L3: unset; Temperature Range Low: -65°C
FB401 = CMP-0220-00181-2: as FB101 on sheet TMC4671; Length: 1.6mm; Termination: SMD/SMT; Case Code (Metric): 1608; Case/Package: SMD/SMT; Min Operating Temperature: -55°C; Resistance: 200mR; Height: 0.8mm; Width: 0.8mm; Max Operating Temperature: 125°C; Package Quantity: 1; Mount: Surface Mount; Max DC Current: 1A; Max Current Rating: 1A; Weight: 0.000141oz; Packaging: Tape and Reel; Lead Free: Lead Free; Case Code (Imperial): 0603; Series: WE-CBF; Impedance: 600R; Core Material: Ferrite; Material: Ferrite; RoHS Compliant: Yes; Depth: 0.8mm
J401 = CMP-1502-03253-1: Micro USB 2.0 Type B Receptacle WR-COM, Horizontal, SMT, with Pads and Pegs; Manufacturer: Wurth Elektronik; Contact Resistance: 30mOhm; Rated Current: 1A; Working Voltage: 30VAC; Datasheet URL: https://katalog.we-online.de/em/datasheet/629105136821.pdf; Mounting Technology: SMT; Publisher: WurthElektronik; Package Reference: 629105136821; Orientation: Horizontal; Packaging: TapeandReel; Part Number: 629105136821; Manufacturer URL: http://www.we-online.de; Connector Type: MicroUSB2.0TypeB; Gender: Receptacle; Operating Temperature: -40to105degC
J402 = 1778641: PCB header, nominal cross section: 0.5 mm?, color: black, nominal current: 6 A, rated voltage (III/2): 160 V, contact surface: Tin, type of contact: Male connector, Number of potentials: 4, Number of rows: 1, Number of positions per row: 4, number of connections: 4, product range: PTSM 0,5/..-HH-THR, pitch: 2.5 mm, mounting: THR soldering, pin layout: Linear pinning, solder pin [P]: 2.1 mm, Stecksystem: COMBICON COMPACT PTSM, Locking: without, type of packaging: 32 mm wide tape; Manufacturer_Name: Phoenix Contact; Geometry.Height: 5.1mm; Manufacturer_Part_Number: 1778641; Mouser Part Number: 651-1778641; Mouser Price/Stock: https://www.mouser.co.uk/ProductDetail/Phoenix-Contact/1778641?qs=i0qWf6NAoDs%252BwkQoFV1ycQ%3D%3D; Arrow Part Number: 1778641; Arrow Price/Stock: https://www.arrow.com/en/products/1778641/phoenix-contact?region=nac; Datasheet Link: http://www.phoenixcontact.com/de/produkte/1778641/pdf
J403 J404 = 1778586: PCB header, nominal cross section: 0.5 mm?, color: black, nominal current: 6 A, rated voltage (III/2): 160 V, contact surface: Tin, type of contact: Male connector, Number of potentials: 6, Number of rows: 1, Number of positions per row: 6, number of connections: 6, product range: PTSM 0,5/..-HH-THR, pitch: 2.5 mm, mounting: THR soldering, pin layout: Linear pinning, solder pin [P]: 2.1 mm, Stecksystem: COMBICON COMPACT PTSM, Locking: without, type of packaging: 32 mm wide tape
J405 = 1778599: PCB header, nominal cross section: 0.5 mm?, color: black, nominal current: 6 A, rated voltage (III/2): 160 V, contact surface: Tin, type of contact: Male connector, Number of potentials: 5, Number of rows: 1, Number of positions per row: 5, number of connections: 5, product range: PTSM 0,5/..-HH-THR, pitch: 2.5 mm, mounting: THR soldering, pin layout: Linear pinning, solder pin [P]: 2.1 mm, Stecksystem: COMBICON COMPACT PTSM, Locking: without, type of packaging: 32 mm wide tape
P403 P406 = Header 2: Header, 2-Pin; LatestRevisionDate: 17-Jul-2002; LatestRevisionNote: Re-released for DXP Platform.; Publisher: Altium Limited
P404 = Header 3X2: Header, 3-Pin, Dual row; LatestRevisionDate: 17-Jul-2002; LatestRevisionNote: Re-released for DXP Platform.; Publisher: Altium Limited
P405 = Header 4X2: Header, 4-Pin, Dual row; LatestRevisionDate: 17-Jul-2002; LatestRevisionNote: Re-released for DXP Platform.; Publisher: Altium Limited
P408 P409 = Header 3: Header, 3-Pin; LatestRevisionDate: 17-Jul-2002; LatestRevisionNote: Re-released for DXP Platform.; Publisher: Altium Limited

## Sheet MOSFETs.SchDoc
size A4; SheetNumber: 7; SheetTotal: 7
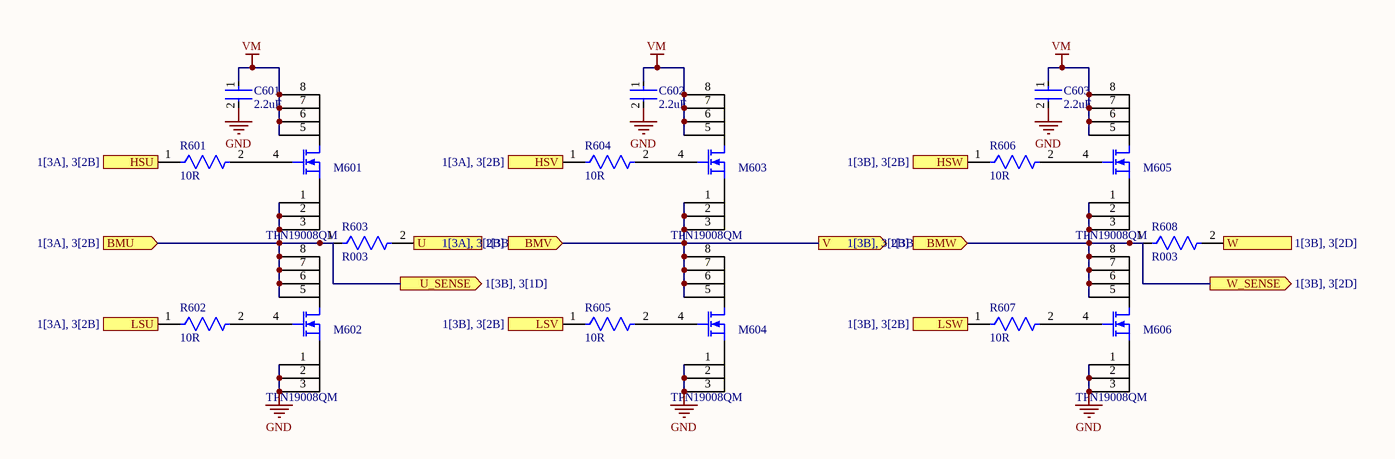
[diagram p3: MOSFETs.SchDoc]

### Parts
C601  2.2uF  [FP-CL32-IPC_B]
C602  2.2uF  [FP-CL32-IPC_B]
C603  2.2uF  [FP-CL32-IPC_B]
M601  TPN19008QM  [TSON Advance_TOS]
M602  TPN19008QM  [TSON Advance_TOS]
M603  TPN19008QM  [TSON Advance_TOS]
M604  TPN19008QM  [TSON Advance_TOS]
M605  TPN19008QM  [TSON Advance_TOS]
M606  TPN19008QM  [TSON Advance_TOS]
R601  10R  [FP-ERJ3EK-IPC_B]
R602  10R  [FP-ERJ3EK-IPC_B]
R603  R003  [FP-CRE2512-R001-R004-IPC_A]
R604  10R  [FP-ERJ3EK-IPC_B]
R605  10R  [FP-ERJ3EK-IPC_B]
R606  10R  [FP-ERJ3EK-IPC_B]
R607  10R  [FP-ERJ3EK-IPC_B]
R608  R003  [FP-CRE2512-R001-R004-IPC_A]

### Ports
BMU (in, see 1[3A], 3[2B]), BMV (in, see 1[3A], 3[2B]), BMW (in, see 1[3B], 3[2B]), HSU (in, see 1[3A], 3[2B]), HSV (in, see 1[3A], 3[2B]), HSW (in, see 1[3B], 3[2B]), LSU (in, see 1[3A], 3[2B]), LSV (in, see 1[3B], 3[2B]), LSW (in, see 1[3B], 3[2B]), U (out, see 1[3B], 3[1D]), U_SENSE (out, see 1[3B], 3[1D]), V (out, see 1[3B]), W (out, see 1[3B], 3[2D]), W_SENSE (out, see 1[3B], 3[2D])

### Nets
GND: C601.2 C602.2 C603.2 M602.1(SOURCE) M602.2(SOURCE) M602.3(SOURCE) M604.1(SOURCE) M604.2(SOURCE) M604.3(SOURCE) M606.1(SOURCE) M606.2(SOURCE) M606.3(SOURCE)
VM: C601.1 C602.1 C603.1 M601.5(DRAIN) M601.6(DRAIN) M601.7(DRAIN) M601.8(DRAIN) M603.5(DRAIN) M603.6(DRAIN) M603.7(DRAIN) M603.8(DRAIN) M605.5(DRAIN) M605.6(DRAIN) M605.7(DRAIN) M605.8(DRAIN)
NetC203_2: M601.1(SOURCE) M601.2(SOURCE) M601.3(SOURCE) M602.5(DRAIN) M602.6(DRAIN) M602.7(DRAIN) M602.8(DRAIN) R603.1 ; port BMU, port U_SENSE
NetC205_2: M603.1(SOURCE) M603.2(SOURCE) M603.3(SOURCE) M604.5(DRAIN) M604.6(DRAIN) M604.7(DRAIN) M604.8(DRAIN) ; port V, port BMV
NetC206_2: M605.1(SOURCE) M605.2(SOURCE) M605.3(SOURCE) M606.5(DRAIN) M606.6(DRAIN) M606.7(DRAIN) M606.8(DRAIN) R608.1 ; port BMW, port W_SENSE
NetM601_4: M601.4(GATE) R601.2
NetM602_4: M602.4(GATE) R602.2
NetM603_4: M603.4(GATE) R604.2
NetM604_4: M604.4(GATE) R605.2
NetM605_4: M605.4(GATE) R606.2
NetM606_4: M606.4(GATE) R607.2
NetP410_1: R603.2 ; port U
NetP410_3: R608.2 ; port W
NetR601_1: R601.1 ; port HSU
NetR602_1: R602.1 ; port LSU
NetR604_1: R604.1 ; port HSV
NetR605_1: R605.1 ; port LSV
NetR606_1: R606.1 ; port HSW
NetR607_1: R607.1 ; port LSW

### Library data of the parts
C601-C603 = CMP-13271-002674-1: Cap Ceramic 2.2uF 100V X7R ±10% SMD 1210 +125°C Embossed T/R; Contact Plating: Tin; Tolerance: 10%; Case Code (Imperial): 1210; Height: 2.5mm; Case/Package: 1210; Mount: Surface Mount; Length: 3.2mm; Width: 0.098inch; Capacitance: 2.2uF; Voltage Rating: 100V; Max Operating Temperature: 125°C; Case Code (Metric): 3225; Packaging: Tape and Reel; Depth: 2.5mm; Voltage: 100V; Package Quantity: 1; Min Operating Temperature: -55°C; Radiation Hardening: No; Thickness: 0.106inch; Dielectric: X7R
M601-M606 = TPN19008QM: No Description Available; Mfr_Name: Toshiba Electronic Devices & Storage Corp.; RefDes: RefDes; Type: Type
R601 R602 R604-R607 = CMP-2000-00195-2: RES SMD 10 OHM 1% 1/10W 0603; Manufacturer Part Number: ERJ-3EKF10R0V; Manufacturer: Panasonic; Resistance: 10Ω; Voltage Rating: 75V; Value: 10Ω; Power: 100mW; Power Rating: 0.1W; Temperature Coefficient: 100ppm/°C; Automotive Grade: Grade 0; Lead Free: Yes; Device Class L1: Passive Components; Digikey Description: RES SMD 10 OHM 1% 1/10W 0603; Octopart: https://octopart.com/erj-3ekf10r0v-panasonic-55403649; Automotive: Yes; ComponentLink2URL: https://b2b-api.panasonic.eu/file_stream/pids/fileversion/1263; Height: 0.55mm; Temperature Range High: +155°C; Footprint Url: https://industrial.panasonic.com/cdbs/www-data/pdf/RDA0000/DMA0000COL17.pdf; Temperature: -55°C to +155°C; Tolerance: 1%; ComponentLink2Description: Datasheet; Package: ERJ3EK; Device Class L2: Resistors; Category: Res; Ipc Land Pattern Name: RESC16080X45; RoHS: TRUE; Composition: Thick Film; Device Class L3: Chip SMD Resistors; Temperature Range Low: -55°C; Series: ERJ
R603 R608 = CMP-07231-007668-1: RES 0.003 OHM 1% 3W 2512; Resistance: 3mR; Temperature Coefficient: 75ppm/°C; Mount: Surface Mount; Max Operating Temperature: 170°C; Min Operating Temperature: -55°C; Technology: METAL STRIP; Series: CRE2512; Case Code (Metric): 6432; Depth: 3.35mm; Case Code (Imperial): 2512; Width: 0.132inch; Case/Package: 2512; Packaging: Cut Tape; REACH SVHC: No SVHC; Resistance Tolerance: 1%; Termination: Solder; Tolerance: 1%; Features: Moisture Resistant; RoHS Compliant: No; Height: 0.035inch; Resistor Type: Metal Alloy; Power Rating: 3W; Number of Terminations: 2; Length: 0.254inch; Contact Plating: Tin; Max Power Dissipation: 3W

## Sheet Power.SchDoc
size A4; SheetNumber: 7; SheetTotal: 7
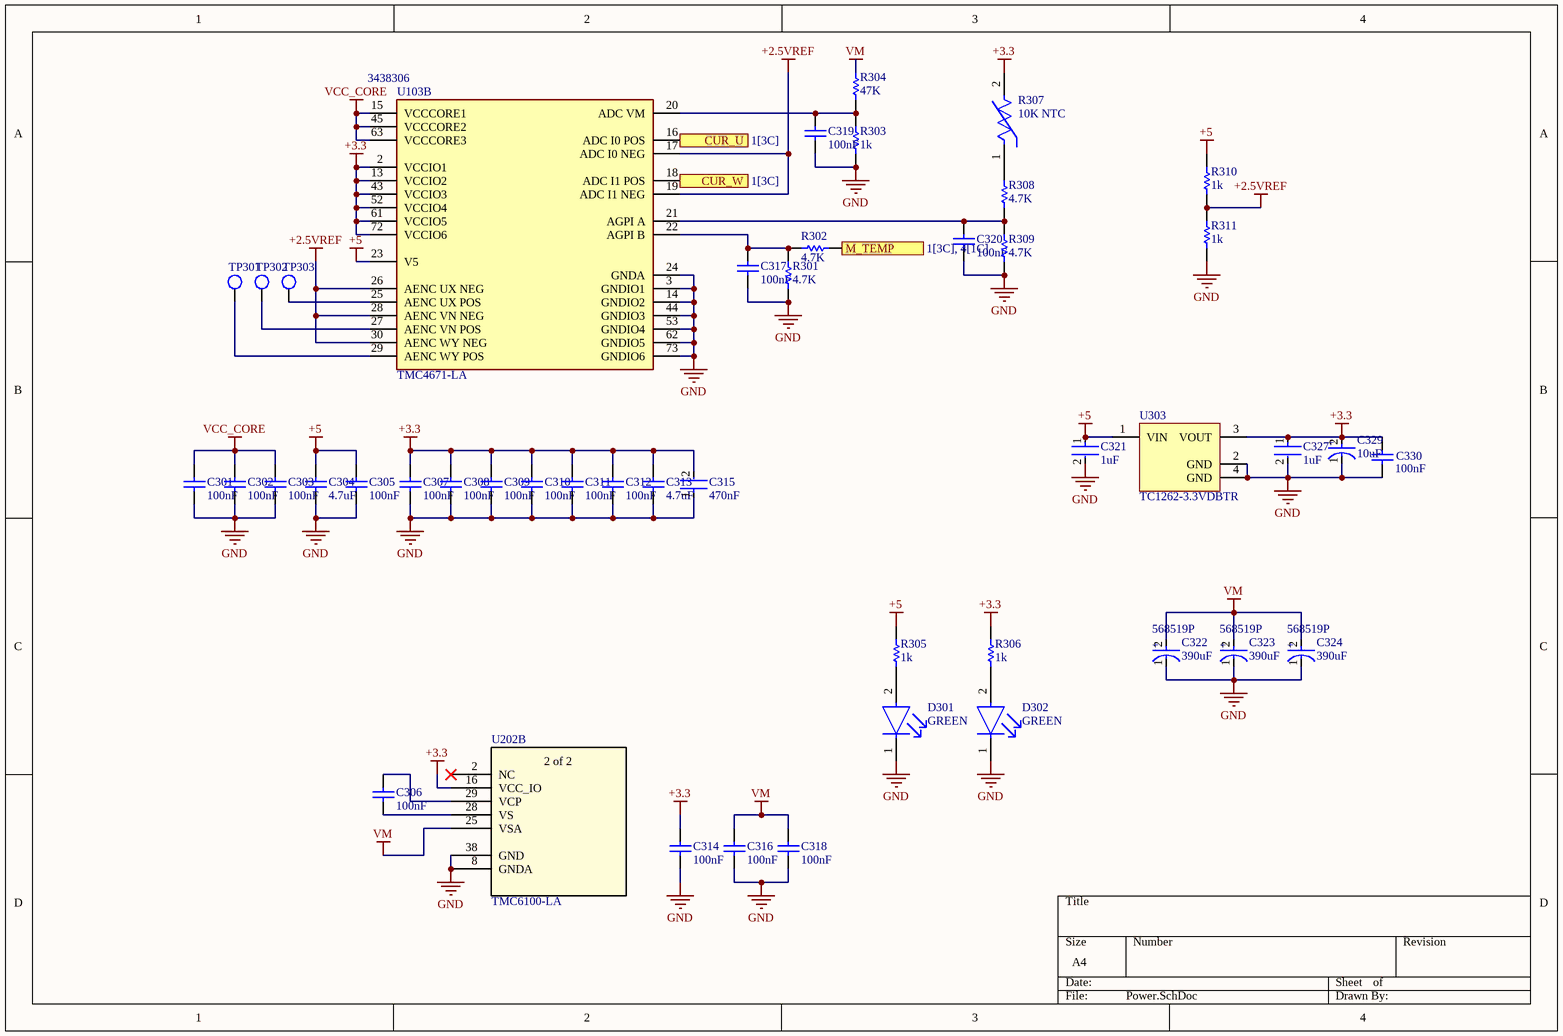
[diagram p4: Power.SchDoc]

### Parts
C301  100nF  [CAPC1608X90X35NL10T15]
C302  100nF  [CAPC1608X90X35NL10T15]
C303  100nF  [CAPC1608X90X35NL10T15]
C304  4.7uF  [CAPC2013X145X50ML20T25]
C305  100nF  [CAPC1608X90X35NL10T15]
C306  100nF  [CAPC2013X145X20ML20]
C307  100nF  [CAPC1608X90X35NL10T15]
C308  100nF  [CAPC1608X90X35NL10T15]
C309  100nF  [CAPC1608X90X35NL10T15]
C310  100nF  [CAPC1608X90X35NL10T15]
C311  100nF  [CAPC1608X90X35NL10T15]
C312  100nF  [CAPC1608X90X35NL10T15]
C313  4.7uF  [CAPC2013X145X50ML20T25]
C314  100nF  [CAPC1608X90X35NL10T15]
C315  470nF  [FP-0603-L_1_6_0_1-W_0_8_0-IPC_B]
C316  100nF  [CAPC2013X145X20ML20]
C317  100nF  [CAPC1608X90X35NL10T15]
C318  100nF  [CAPC2013X145X20ML20]
C319  100nF  [CAPC1608X90X35NL10T15]
C320  100nF  [CAPC1608X90X35NL10T15]
C321  1uF  [FP-CL10-IPC_B]
C322  390uF  Supplier Part Number 1: 568519P  [FP-FC-G-MFG]
C323  390uF  Supplier Part Number 1: 568519P  [FP-FC-G-MFG]
C324  390uF  Supplier Part Number 1: 568519P  [FP-FC-G-MFG]
C327  1uF  [FP-CL10-IPC_B]
C329  10uF  [FP-TAJA-MFG]
C330  100nF  [CAPC1608X90X35NL10T15]
D301  GREEN  [FP-LTST-C190GKT-MFG]
D302  GREEN  [FP-LTST-C190GKT-MFG]
R301  4.7K  [RESC1608X55X30NL15T15]
R302  4.7K  [RESC1608X55X30NL15T15]
R303  1k  [RESC1608X55X30ML15T15]
R304  47K  [RESC1608X55X30NL15T15]
R305  1k  [RESC1608X55X30ML15T15]
R306  1k  [RESC1608X55X30ML15T15]
R307  10K NTC  [FP-NCP18-0_15-IPC_A]
R308  4.7K  [RESC1608X55X30NL15T15]
R309  4.7K  [RESC1608X55X30NL15T15]
R310  1k  [RESC1608X55X30ML15T15]
R311  1k  [RESC1608X55X30ML15T15]
TP301  TestPoint  [PCBComponent_1]  (value not drawn)  (no BOM)
TP302  TestPoint  [PCBComponent_1]  (value not drawn)  (no BOM)
TP303  TestPoint  [PCBComponent_1]  (value not drawn)  (no BOM)
U103  TMC4671-LA  Supplier Part Number 1: 3438306  [FP-TMC4671-LA-IPC_A]  (part B of 2)
U202  TMC6100-LA  [QFN37_7X7_TRI-M]  (part B of 2)
U303  TC1262-3.3VDBTR  [SOT-223-DB3_N]

### Ports
CUR_U (in, see 1[3C]), CUR_W (in, see 1[3C]), M_TEMP (in, see 1[3C], 4[1C])

### Nets
+2.5VREF: R310.1 R311.2 U103.17(ADC_I0_NEG) U103.19(ADC_I1_NEG) U103.26(AENC_UX_NEG) U103.28(AENC_VN_NEG) U103.30(AENC_WY_NEG)
+3.3: C307.2 C308.2 C309.2 C310.2 C311.2 C312.2 C313.2 C314.2 C315.2 C327.1 C329.2(A) C330.2 R306.2 R307.2 U103.2(VCCIO1) U103.13(VCCIO2) U103.43(VCCIO3) U103.52(VCCIO4) U103.61(VCCIO5) U103.72(VCCIO6) U202.16(VCC_IO) U303.3(VOUT)
+5: C304.2 C305.2 C321.1 R305.2 R310.2 U103.23(V5) U303.1(VIN)
GND: C301.1 C302.1 C303.1 C304.1 C305.1 C307.1 C308.1 C309.1 C310.1 C311.1 C312.1 C313.1 C314.1 C315.1 C316.2 C317.1 C318.2 C319.1 C320.1 C321.2 C322.1(C) C323.1(C) C324.1(C) C327.2 C329.1(C) C330.1 D301.1(C) D302.1(C) R301.1 R303.1 R309.1 R311.1 U103.3(GNDIO1) U103.14(GNDIO2) U103.24(GNDA) U103.44(GNDIO3) U103.53(GNDIO4) U103.62(GNDIO5) U103.73(GNDIO6) U202.8(GNDA) U202.38(GND) U303.2(GND) U303.4(GND)
VCC_CORE: C301.2 C302.2 C303.2 U103.15(VCCCORE1) U103.45(VCCCORE2) U103.63(VCCCORE3)
VM: C316.1 C318.1 C322.2(A) C323.2(A) C324.2(A) R304.2 U202.25(VSA)
NetC202_2: U103.16(ADC_I0_POS) ; port CUR_U
NetC210_2: U103.18(ADC_I1_POS) ; port CUR_W
NetC306_1: C306.1 U202.29(VCP)
NetC306_2: C306.2 U202.28(VS)
NetC317_2: C317.2 R301.2 R302.1 U103.22(AGPI_B)
NetC319_2: C319.2 R303.2 R304.1 U103.20(ADC_VM)
NetC320_2: C320.2 R308.1 R309.2 U103.21(AGPI_A)
NetD301_2: D301.2(A) R305.1
NetD302_2: D302.2(A) R306.1
NetP403_1: R302.2 ; port M_TEMP
NetR307_1: R307.1 R308.2
NetTP301_1: TP301.1 U103.29(AENC_WY_POS)
NetTP302_1: TP302.1 U103.27(AENC_VN_POS)
NetTP303_1: TP303.1 U103.25(AENC_UX_POS)

Not connected (* = marked no-connect by the designer): U202 2(NC)*

### Notes on the sheet
- (in symbol CMP-2000-07217-2) +
- (in symbol CMP-05427-002152-1) +
- (in symbol TMC6100-LA, part B) 2 of 2

### Library data of the parts
C301-C303 C305 C307-C312 C314 C317 C319 C320 C330 = CMP-2100-03643-1: as C103 on sheet TMC4671; Case Code (Metric): 1608; Lead Free: LeadFree; Depth: 0.8mm; Number of Pins: 2; Radiation Hardening: No; Case/Package: 0603; Manufacturer URL: http://www.murata.com/; Packaging: TapeandReel; Length: 1.6mm; Contact Plating: Tin; Datasheet URL: http://psearch.en.murata.com/capacitor/product/GRM188R71H104KA93%23.pdf; Tolerance: 10%; Case Code (Imperial): 0603; Min Operating Temperature: -55degC; RoHSCompliant: true; Capacitance: 100nF; Voltage: 50V; Termination: SMD/SMT; Mount: SurfaceMount; Material: Ceramic; Package Quantity: 1; Height: 0.8mm; Thickness: 0.035inch; REACH SVHC: NoSVHC; Max Operating Temperature: 125degC; Width: 0.8mm; Package Reference: 0603; Voltage Rating (DC): 50V; Datasheet Version: 42675.0; Package Description: 2-Pin Surface Mount Device, Body 1.6 x 0.8 mm
C304 C313 = CMP-2007-01048-1: Part Number: C0805C475K4RACTU; Manufacturer: Kemet
C306 C316 C318 = CMP-2000-05453-1: Chip Capacitor, 100 nF, +/- 10%, 100 V, -55 to 1255 degC, 0805 (2012 Metric), RoHS, Tape and Reel; Manufacturer: TDK; PCN Part Number: MLCCPartNumberChange30/Nov/2012; Temperature Coefficient: X7R; Voltage - Rated: 100V; Kits: SAMPLEKIT1008-ND-KITCAPCERMLCC100V-630V; Other Names: 445-1418-1; Online Catalog: CSeries,MidVoltage; Featured Product: C-SeriesMidVoltageMLCCs; Catalog Drawings: CSERIES_2012-0805_1.45; Product Training Modules: HighCapacitanceReplacementSEAT,CCV,andTVCLDesignToolsGuidetoReplacinganElectrolyticCapacitorwithanMLCC; Capacitance: 0.1µF; Applications: GeneralPurpose; Datasheet Version: Jul-13; Mounting Type: SurfaceMount,MLCC; Height - Seated (Max): -; Packaging: CutTape(CT); Datasheet URL: https://datasheet.ciiva.com/11788/0900766b80fc5cba-11788142.pdf; Tolerance: ±10%; Package Reference: 805; Manufacturer URL: http://www.tdk.com/; Thickness (Max): 0.057"(1.45mm); Series: C; Lead Style: -; Operating Temperature: -55degC~125degC; Category: Capacitors; Package Description: 2-Pin Surface Mount Device, Body 2 x 1.25 mm; Standard Package: 1; Package / Case: 0805(2012Metric); Family: CeramicCapacitors; RoHS Information: RoHSCertificate-MLCC; Size / Dimension: 0.079"Lx0.049"W(2.00mmx1.25mm); Lead Spacing: -; Ratings: -; Features: -
C315 = CMP-14477-000135-2: as C203 on sheet TMC6100; Series: M; Package Quantity: 1; Radiation Hardening: No; Packaging: Tape and Reel; Length: 1.6mm; Min Operating Temperature: -55°C; Case Code (Imperial): 0603; Capacitance: 470nF; Construction: Flat; Max Operating Temperature: 125°C; Thickness: 0.035inch; Case Code (Metric): 1608; Depth: 0.8mm; Voltage: 50V; Case/Package: 0603; RoHS Compliant: Yes; Mount: Surface Mount; Lead Free: Lead Free; Width: 0.031inch; Halogen Free: Halogen Free; Height: 0.8mm; Termination: SMD/SMT; Voltage Rating (DC): 50V
C321 C327 = CMP-13271-004127-1: Cap Ceramic 1uF 25V X5R ±10% Pad SMD 0603 +85°C T/R; Height: 0.8mm; Capacitance: 1uF; Depth: 0.8mm; Package Quantity: 1; Mount: Surface Mount; Contact Plating: Tin; Voltage Rating: 25V; Dielectric: X5R; Packaging: Tape and Reel; Material: Ceramic; Case Code (Metric): 1608; Length: 1.6mm; Voltage: 25V; Min Operating Temperature: -55°C; Width: 0.031inch; Tolerance: 10%; Case/Package: 0603; Radiation Hardening: No; Case Code (Imperial): 0603; Thickness: 0.035inch; Lead Free: Lead Free; Max Operating Temperature: 85°C; Voltage Rating (DC): 25V
C322-C324 = CMP-05427-002152-1: Cap Aluminum 390uF 35V 20% (10 X 10.2mm) SMD 0.08 Ohm 850mA 2000 hr 105°C Embossed T/R; Manufacturer: Panasonic; Manufacturer Part Number: EEE-FPV391UAP; Life (Hours): 1000Hour; Leakage Current: 3uA; Ripple Current (AC): 670mA; Material: Aluminium; Impedance: 150mR; Mount: Surface Mount; Construction: Cylindrical; Ratings: AEC-Q200; Radiation Hardening: No; Height: 10.2mm; Height - Seated (Max): 0.402inch; Termination: SMD/SMT; Tolerance: 20%; Packaging: Tape and Reel; Min Operating Temperature: -40°C; Voltage: 35V; Case/Package: Radial; Length: 10.5mm; Ripple Current: 670mA; Contact Plating: Tin; Width: 900um; Voltage Rating (DC): 35V; Diameter: 10mm; Package Quantity: 500; Lead Free: Lead Free; Reach SVHC Compliant: Yes; Series: FC; Max Operating Temperature: 105°C; Voltage Rating: 35V; RoHS Compliant: Yes; ESR (Equivalent Series Resistance): 150mR; Supplier 1: Rs; RoHS: Yes; Category: Aluminum Electrolytic Capacitors; Stock 1: 1245; Mounting Technology: Surface Mount,PCB; Pins: 2; Dielectric Material: Aluminium; Value: 390uF; Lead Pitch: 4.6mm; ComponentLink1URL: https://datasheet.ciiva.com/11781/0900766b80df09a1-11781130.pdf?src-supplier=Rs; ComponentLink1Description: https://datasheet.ciiva.com/11781/0900766b80df09a1-11781130.pdf?src-supplier=Rs; ComponentLink2URL: https://datasheet.ciiva.com/43455/370232-43455030.pdf?src-supplier=Farnell; ComponentLink2Description: https://datasheet.ciiva.com/43455/370232-43455030.pdf?src-supplier=Farnell; ComponentLink3URL: https://datasheet.ciiva.com/46389/370232-46389113.pdf?src-supplier=Element14; ComponentLink3Description: https://datasheet.ciiva.com/46389/370232-46389113.pdf?src-supplier=Element14; ComponentLink4URL: https://datasheet.ciiva.com/6056/370232-6056250.pdf?src-supplier=Farnell; ComponentLink4Description: https://datasheet.ciiva.com/6056/370232-6056250.pdf?src-supplier=Farnell; ComponentLink5URL: https://datasheet.ciiva.com/46376/370232-46376775.pdf?src-supplier=Element14; ComponentLink5Description: https://datasheet.ciiva.com/46376/370232-46376775.pdf?src-supplier=Element14; ComponentLink6URL: https://datasheet.ciiva.com/48523/fp-eng-tds-48523563.pdf?src-supplier=Distrelec; ComponentLink6Description: https://datasheet.ciiva.com/48523/fp-eng-tds-48523563.pdf?src-supplier=Distrelec; ComponentLink7URL: https://datasheet.ciiva.com/46385/370232-46385721.pdf?src-supplier=Element14; ComponentLink7Description: https://datasheet.ciiva.com/46385/370232-46385721.pdf?src-supplier=Element14; ComponentLink8URL: https://datasheet.ciiva.com/14592/70068195-14592253.pdf?src-supplier=Allied+Electronics; ComponentLink8Description: https://datasheet.ciiva.com/14592/70068195-14592253.pdf?src-supplier=Allied+Electronics; ComponentLink9URL: https://datasheet.ciiva.com/14602/70068195-14602173.pdf?src-supplier=Allied+Electronics; ComponentLink9Description: https://datasheet.ciiva.com/14602/70068195-14602173.pdf?src-supplier=Allied+Electronics; ComponentLink10URL: https://datasheet.ciiva.com/2985/aba0000ce114-2985565.pdf?src-supplier=Avnet; ComponentLink10Description: https://datasheet.ciiva.com/2985/aba0000ce114-2985565.pdf?src-supplier=Avnet; ComponentLink11URL: https://datasheet.ciiva.com/2985/aba0000ce114-2985566.pdf?src-supplier=Avnet; ComponentLink11Description: https://datasheet.ciiva.com/2985/aba0000ce114-2985566.pdf?src-supplier=Avnet; ComponentLink12URL: https://datasheet.ciiva.com/30055/aba0000ce114-30055453.pdf?src-supplier=Onlinecomponents.com; ComponentLink12Description: https://datasheet.ciiva.com/30055/aba0000ce114-30055453.pdf?src-supplier=Onlinecomponents.com; ComponentLink13URL: https://datasheet.ciiva.com/29356/806562-da-01-en-smd-elko-vfp-g-390-uf-35-0-v-105c-29356474.pdf?src-supplier=Conrad; ComponentLink13Description: https://datasheet.ciiva.com/29356/806562-da-01-en-smd-elko-vfp-g-390-uf-35-0-v-105c-29356474.pdf?src-supplier=Conrad
C329 = CMP-2000-07217-2: 10uF 10V  ±10% 3Ω 1206  SMD Tantalum Capacitor; ESR (Equivalent Series Resistance): 3R; Dissipation Factor: 6%; Leakage Current: 1uA; Polarity: Polar; Q Factor: 6; Case Code (Imperial): 1206; RoHS Compliant: Yes; Case Code (Metric): 3216; Voltage Rating (DC): 10V; REACH SVHC: No SVHC; Mount: Surface Mount; Package Quantity: 1; Radiation Hardening: No; Width: 1.6mm; Depth: 1.6mm; Packaging: Tape and Reel; Termination: SMD/SMT; Length: 3.2mm; Tolerance: 10%; Features: General Purpose; Capacitance: 10uF; Case/Package: 1206; Max Operating Temperature: 125°C; Voltage Rating: 10V; Height - Seated (Max): 0.071inch; Series: TAJ; Height: 1.6mm; Min Operating Temperature: -55°C; Voltage: 10V; Number of Pins: 2; Construction: Flat; Dielectric Material: Tantalum; Lead Free: Lead Free
D301 D302 = CMP-22017-000005-2: LED GREEN CLEAR CHIP SMD; Dominant Wavelength: 569nm; Reverse Voltage: 5V; Lens Color: Colorless; Viewing Angle: 130°; Voltage: 2V; Forward Current: 30mA; Power Dissipation: 100mW; Luminous Intensity: 6mcd; Number of LEDs: 1; Forward Voltage: 2.1V; Wavelength: 565nm; Test Current: 10mA; Min Operating Temperature: -55°C; Lens Style: Clear; Mount: Surface Mount; Width: 0.8mm; Packaging: Tape and Reel; Lens Transparency: Clear; Case Code (Metric): 1608; Depth: 0.8mm; Case Code (Imperial): 0603; Case/Package: 0603; Number of Pins: 2; Max Operating Temperature: 85°C; Lead Free: Lead Free; Number of Elements: 1; Length: 1.6mm; Height: 0.8mm; Package Quantity: 1; Power Rating: 100mW; Radiation Hardening: No; Illumination Color: Green; Color: Green
R301 R302 R308 R309 = CMP-1012-00586-3: as R101 on sheet TMC4671; PackageReference: 0603; Max Operating Temperature: 125 degC; REACH SVHC: No SVHC; Width: 0.063 inch; Length: 0.126 inch; Height: 0.024 inch; Mount: Surface Mount; Package Quantity: 1; DatasheetVersion: Apr-15; ComponentLink1Description: Manufacturer URL; Min Operating Temperature: -55 degC; Packaging: Tape and Reel; Radiation Hardening: No; ComponentLink2URL: http://industrial.panasonic.com/cdbs/www-data/pdf/RDA0000/AOA0000C86.pdf; Case Code (Metric): 3216; Pins: 8; Case Code (Imperial): 1206; Type (Resistor): Thick Film; RoHSCompliant: true; ComponentLink2Description: Datasheet; PackageDescription: 2-Pin Surface Mount Device, Body 1.6 x 0.85 mm; ComponentLink1URL: http://www.panasonic.com/
R303 R305 R306 R310 R311 = CMP-2000-00180-1: as R107 on sheet TMC4671
R304 = CMP-2000-00523-2: Chip Resistor, 47 KOhm, +/- 1%, 0.1 W, -55 to 155 degC, 0603 (1608 Metric), RoHS, Tape and Reel; Case\Package: 0603; Forward Current: 20 mA; Power Rating: 90 mW; Illumination Colour: Red; Nominal Vf: 2.1 V; Viewing Angle: 160 degrees; Luminous Intensity: 63 mcd; Lens Style: Clear; Nominal Wavelength: 639 nm; Case Code (Imperial): 0603; Case Code (Metric): 1608; Packaging: Tape and Reel; Radiation Hardening: No; Colour: Red; PackageDescription: 2-Pin Surface Mount Device, Body 1.6 x 0.85 mm; ComponentLink1Description: Manufacturer URL; Width: 0.8 mm; DatasheetVersion: Apr-15; ComponentLink2URL: http://industrial.panasonic.com/cdbs/www-data/pdf/RDA0000/AOA0000C86.pdf; Min Operating Temperature: -40 degC; Height: 0.6 mm; Package Quantity: 3000; ComponentLink2Description: Datasheet; REACH SVHC: No SVHC; ComponentLink1URL: http://www.panasonic.com/; Mount: Surface Mount; RoHSCompliant: true; Max Operating Temperature: 100 degC; PackageReference: 0603; Length: 1.6 mm; Forward Voltage: 2.1 V; Pins: 2
R307 = CMP-2000-05271-3: NTC Thermistor for Temperature Sensor, 0603, 10kΩ, 1%, 0.1mA, 5V; Manufacturer Series: NCP18; Accuracy: 0.7%; Current Rating: 310uA; Max Power Dissipation: 100mW; Thermistor Application: TEMPERATURE COMPENSATION; Number of Terminals/Pins: 2; Resistance: 10kR; Case Code (Metric): 1608; RoHS Compliant: Yes; Max Operating Temperature: 125°C; Resistance Tolerance: 1%; Case/Package: 0603; Mount: Surface Mount; Lead Free: Lead Free; Min Operating Temperature: -40°C; REACH SVHC: No SVHC; Package Shape: Rectangular; Radiation Hardening: No; Series: NCP; Depth: 0.8mm; Number of Pins: 2; Length: 1.6mm; Height: 0.8mm; Terminal Placement: Dual; Tolerance: 1%; Case Code (Imperial): 0603; Terminal Finish: Tin; Power Rating: 100mW; Termination: SMD/SMT; Packaging: Tape and Reel; Package Quantity: 1
U103 = CMP-237673-000008-1: SERVO CONTROLLER IC, QFN76; Supplier 1: Farnell
U202 = TMC6100-LA: as U202 on sheet TMC6100; RefDes: RefDes; Type: Type
U303 = CMP-0136-00481-1: 500mA Fixed Output CMOS LDO, 3-Pin SOT-223, Extended Temperature, Tape and Reel; PackageVersion: revBB, Aug-2009; PackageDescription: 3-Lead Plastic Small Outline Transistor (DB) [SOT-223]; DatasheetVersion: revB, 2002; PackageReference: SOT-223-DB3